# Altium project WV240-E-D001-MC Rev.1.0.PrjPCB
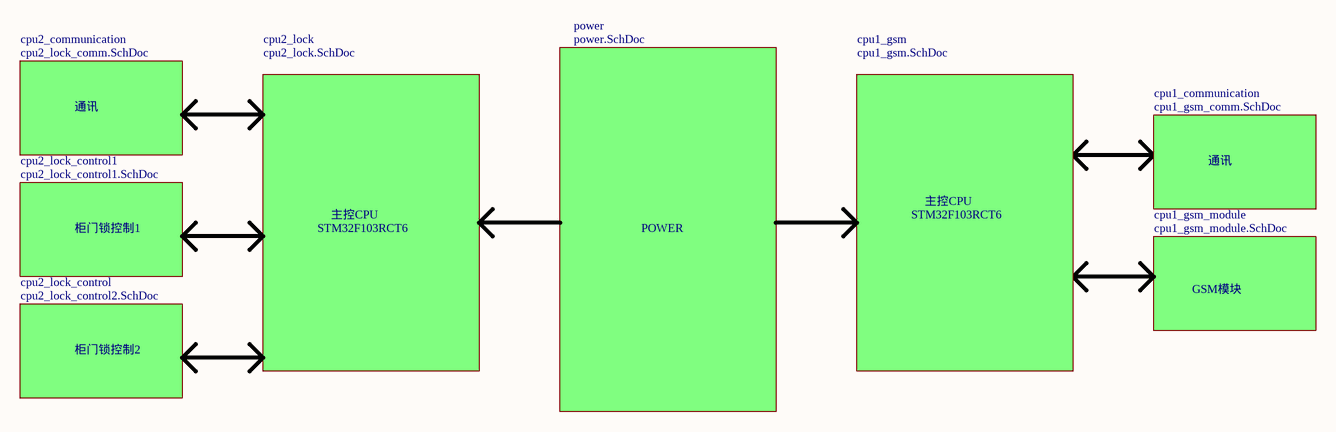
[diagram p0: WV240-E-D001-MC Rev.1.0.SchDoc]
9 sheets, 287 parts. Net scope: global (net labels, ports and power ports of the same name join across sheets).
Board files: WV240-E-D001-MC Rev.1.0.PcbDoc, chicun.PcbDoc
Sheets:
  WV240-E-D001-MC Rev.1.0.SchDoc
    cpu2_lock = cpu2_lock.SchDoc
    cpu1_gsm_module = cpu1_gsm_module.SchDoc
    cpu2_communication = cpu2_lock_comm.SchDoc
    cpu2_lock_control1 = cpu2_lock_control1.SchDoc
    power = power.SchDoc
    cpu1_gsm = cpu1_gsm.SchDoc
    cpu1_communication = cpu1_gsm_comm.SchDoc
    cpu2_lock_control = cpu2_lock_control2.SchDoc

## Sheet WV240-E-D001-MC Rev.1.0.SchDoc
size A3; DocumentNumber: 1; Revision: V1.0; SheetNumber: 1; SheetTotal: 9; Rule: PcbType=ProtelPcb

### Sub-sheets
cpu1_communication = cpu1_gsm_comm.SchDoc: no entries
cpu1_gsm = cpu1_gsm.SchDoc: no entries
cpu1_gsm_module = cpu1_gsm_module.SchDoc: no entries
cpu2_communication = cpu2_lock_comm.SchDoc: no entries
cpu2_lock = cpu2_lock.SchDoc: no entries
cpu2_lock_control = cpu2_lock_control2.SchDoc: no entries
cpu2_lock_control1 = cpu2_lock_control1.SchDoc: no entries
power = power.SchDoc: no entries

### Notes on the sheet
- 通讯
- 主控CPU
- 柜门锁控制1
- STM32F103RCT6
- POWER
- GSM模块
- 柜门锁控制2
- :

## Sheet cpu2_lock.SchDoc
size A3; DocumentNumber: 6; Revision: V1.0; SheetNumber: 6; SheetTotal: 9; Rule: PcbType=ProtelPcb
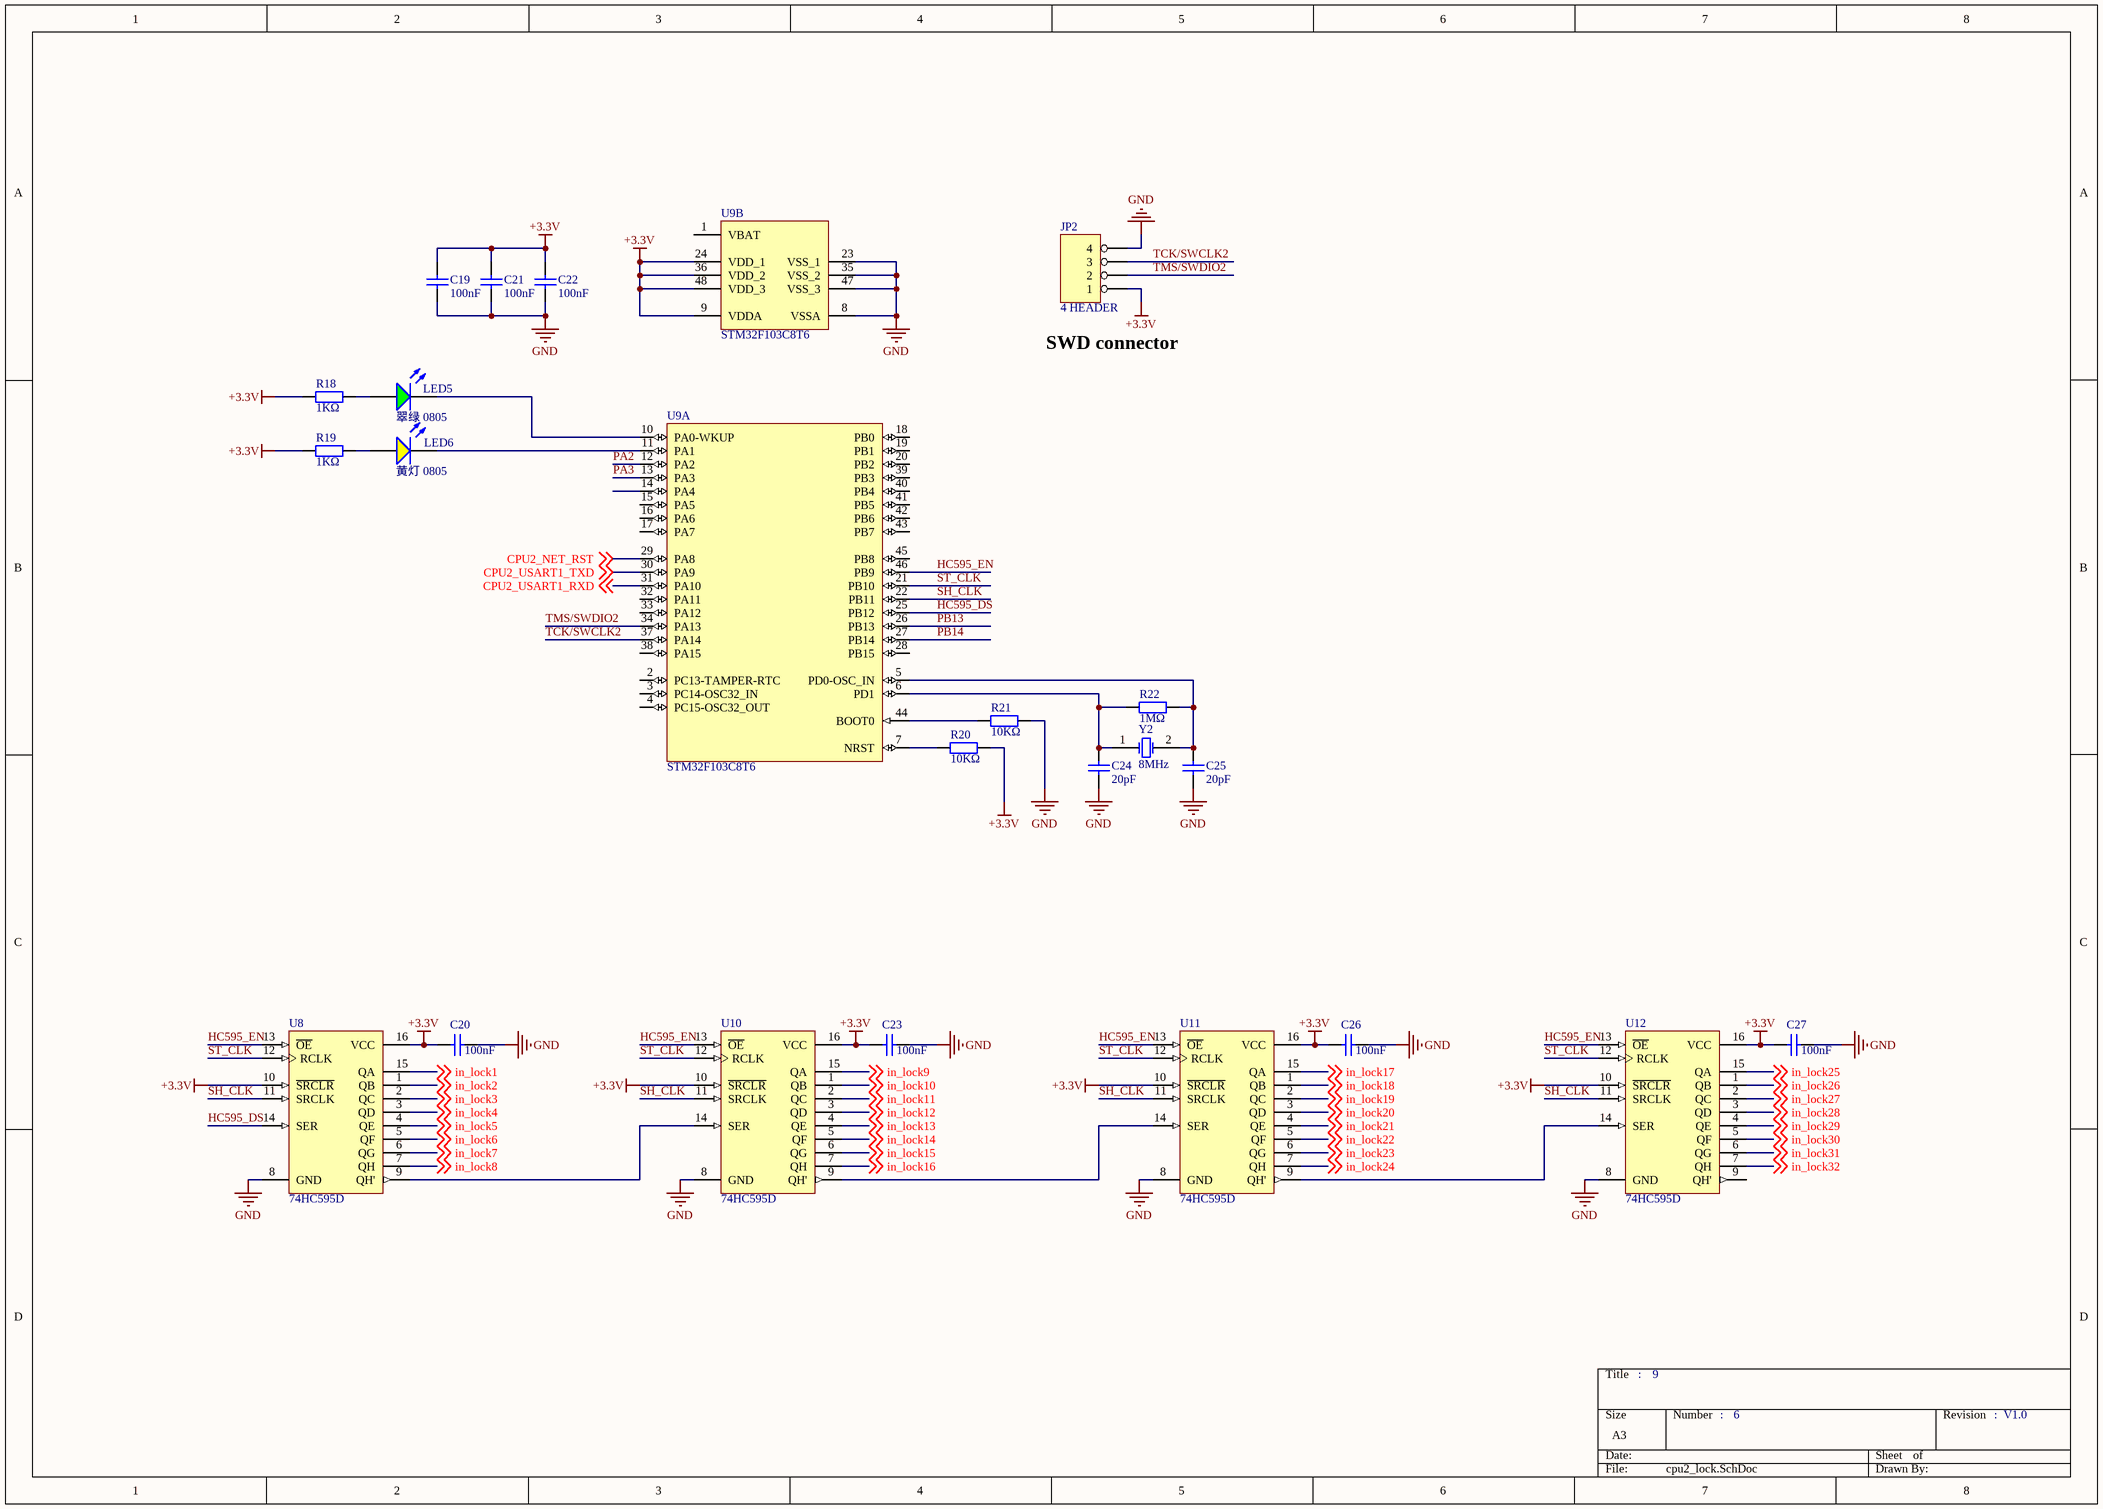
[diagram p1: cpu2_lock.SchDoc]

### Parts
C19  100nF  [0805_C]
C20  100nF  [0805_C]
C21  100nF  [0805_C]
C22  100nF  [0805_C]
C23  100nF  [0805_C]
C24  20pF  [0805_C]
C25  20pF  [0805_C]
C26  100nF  [0805_C]
C27  100nF  [0805_C]
JP2  4 HEADER  [CON4_1.5]
LED5  翠绿 0805  [0805_LED_S1]
LED6  黄灯 0805  [0805_LED_S1]
R18  1KΩ  [0805_R]
R19  1KΩ  [0805_R]
R20  10KΩ  [0805_R]
R21  10KΩ  [0805_R]
R22  1MΩ  [0805_R]
U8  74HC595D  [SOIC-16_150mil]
U9  STM32F103C8T6  [LQFP-48_7x7x05P]  (parts A,B of 2)
U10  74HC595D  [SOIC-16_150mil]
U11  74HC595D  [SOIC-16_150mil]
U12  74HC595D  [SOIC-16_150mil]
Y2  8MHz  [XTAL_US1]

### Nets
+3.3V: C19.2 C20.2 C21.2 C22.2 C23.2 C26.2 C27.2 JP2.1 R18.1 R19.1 R20.1 U8.10(~{SRCLR}) U8.16(VCC) U9.9(VDDA) U9.24(VDD_1) U9.36(VDD_2) U9.48(VDD_3) U10.10(~{SRCLR}) U10.16(VCC) U11.10(~{SRCLR}) U11.16(VCC) U12.10(~{SRCLR}) U12.16(VCC)
GND: C19.1 C20.1 C21.1 C22.1 C23.1 C24.1 C25.1 C26.1 C27.1 JP2.4 R21.1 U8.8(GND) U9.8(VSSA) U9.23(VSS_1) U9.35(VSS_2) U9.47(VSS_3) U10.8(GND) U11.8(GND) U12.8(GND)
CPU2_NET_RST: U9.29(PA8) ; off-sheet CPU2_NET_RST
CPU2_USART1_RXD: U9.31(PA10) ; off-sheet CPU2_USART1_RXD
CPU2_USART1_TXD: U9.30(PA9) ; off-sheet CPU2_USART1_TXD
HC595_DS: U8.14(SER) U9.25(PB12)
HC595_EN: U8.13(~{OE}) U9.46(PB9) U10.13(~{OE}) U11.13(~{OE}) U12.13(~{OE})
in_lock1: U8.15(QA) ; off-sheet in_lock1
in_lock2: U8.1(QB) ; off-sheet in_lock2
in_lock3: U8.2(QC) ; off-sheet in_lock3
in_lock4: U8.3(QD) ; off-sheet in_lock4
in_lock5: U8.4(QE) ; off-sheet in_lock5
in_lock6: U8.5(QF) ; off-sheet in_lock6
in_lock7: U8.6(QG) ; off-sheet in_lock7
in_lock8: U8.7(QH) ; off-sheet in_lock8
in_lock9: U10.15(QA) ; off-sheet in_lock9
in_lock10: U10.1(QB) ; off-sheet in_lock10
in_lock11: U10.2(QC) ; off-sheet in_lock11
in_lock12: U10.3(QD) ; off-sheet in_lock12
in_lock13: U10.4(QE) ; off-sheet in_lock13
in_lock14: U10.5(QF) ; off-sheet in_lock14
in_lock15: U10.6(QG) ; off-sheet in_lock15
in_lock16: U10.7(QH) ; off-sheet in_lock16
in_lock17: U11.15(QA) ; off-sheet in_lock17
in_lock18: U11.1(QB) ; off-sheet in_lock18
in_lock19: U11.2(QC) ; off-sheet in_lock19
in_lock20: U11.3(QD) ; off-sheet in_lock20
in_lock21: U11.4(QE) ; off-sheet in_lock21
in_lock22: U11.5(QF) ; off-sheet in_lock22
in_lock23: U11.6(QG) ; off-sheet in_lock23
in_lock24: U11.7(QH) ; off-sheet in_lock24
in_lock25: U12.15(QA) ; off-sheet in_lock25
in_lock26: U12.1(QB) ; off-sheet in_lock26
in_lock27: U12.2(QC) ; off-sheet in_lock27
in_lock28: U12.3(QD) ; off-sheet in_lock28
in_lock29: U12.4(QE) ; off-sheet in_lock29
in_lock30: U12.5(QF) ; off-sheet in_lock30
in_lock31: U12.6(QG) ; off-sheet in_lock31
in_lock32: U12.7(QH) ; off-sheet in_lock32
PA2: U9.12(PA2)
PA3: U9.13(PA3)
PB13: U9.26(PB13)
PB14: U9.27(PB14)
SH_CLK: U8.11(SRCLK) U9.22(PB11) U10.11(SRCLK) U11.11(SRCLK) U12.11(SRCLK)
ST_CLK: U8.12(RCLK) U9.21(PB10) U10.12(RCLK) U11.12(RCLK) U12.12(RCLK)
TCK/SWCLK2: JP2.3 U9.37(PA14)
TMS/SWDIO2: JP2.2 U9.34(PA13)
NetC24_2: C24.2 R22.2 U9.6(PD1) Y2.1(OSC1)
NetC25_2: C25.2 R22.1 U9.5(PD0-OSC_IN) Y2.2(OSC2)
NetLED5_A: LED5.A R18.2
NetLED5_K: LED5.K U9.10(PA0-WKUP)
NetLED6_A: LED6.A R19.2
NetLED6_K: LED6.K U9.11(PA1)
NetR20_2: R20.2 U9.7(NRST)
NetR21_2: R21.2 U9.44(BOOT0)
NetU8_9: U8.9(QH') U10.14(SER)
NetU10_9: U10.9(QH') U11.14(SER)
NetU11_9: U11.9(QH') U12.14(SER)

Not connected (* = marked no-connect by the designer): U9 1(VBAT) 2(PC13-TAMPER-RTC) 3(PC14-OSC32_IN) 4(PC15-OSC32_OUT) 14(PA4) 15(PA5) 16(PA6) 17(PA7) 18(PB0) 19(PB1) 20(PB2) 28(PB15) 32(PA11) 33(PA12) 38(PA15) 39(PB3) 40(PB4) 41(PB5) 42(PB6) 43(PB7) 45(PB8); U12 9(QH')

### Notes on the sheet
- (near JP2) SWD connector
- :

### Library data of the parts
C19-C27 = 0805 100nF(104) 10% 50V: 贴片电容; ComponentLink1Description: 供应商链接; ComponentLink1URL: http://www.szlcsc.com/product/details_50686.html; Package: 0805; Supplier: LC; SuppliersPartNumber: C49678
JP2 = 4 HEADER: 4 Pin Header
LED5 = 0805 翠绿: 发光二极管; ComponentLink1Description: 供应商链接; ComponentLink1URL: http://www.szlcsc.com/product/details_2670.html; Package: 0805; Supplier: LC; SuppliersPartNumber: C2297
LED6 = 0805 黄灯: 发光二极管; ComponentLink1Description: 供应商链接; ComponentLink1URL: http://www.szlcsc.com/product/details_2669.html; Package: 0805; Supplier: LC; SuppliersPartNumber: C2296
R18-R22 = 0805 11KΩ (1102) 1%: 贴片电阻; ComponentLink1Description: 供应商链接; ComponentLink1URL: http://www.szlcsc.com/product/details_18117.html; Package: 0805; Supplier: LC; SuppliersPartNumber: C17429
U8 U10-U12 = 74HC595D: 74系列逻辑芯片; ComponentLink1Description: 供应商链接; ComponentLink1URL: http://www.szlcsc.com/product/details_6413.html; Package: SOIC-16_150mil; Supplier: LC; SuppliersPartNumber: C5947
U9 = STM32F103C8T6: ARM; ComponentLink1Description: 供应商链接; ComponentLink1URL: http://www.szlcsc.com/product/details_9243.html; Package: LQFP-48_7x7x05P; Supplier: LC; SuppliersPartNumber: C8734
Y2 = XTAL: Crystal Oscillator; Published: 8-Jun-2000; LatestRevisionDate: 17-Jul-2002; LatestRevisionNote: Re-released for DXP Platform.; Publisher: Altium Limited

## Sheet cpu1_gsm_module.SchDoc
size A3; DocumentNumber: 5; Revision: V1.0; SheetNumber: 5; SheetTotal: 9; Rule: PcbType=ProtelPcb
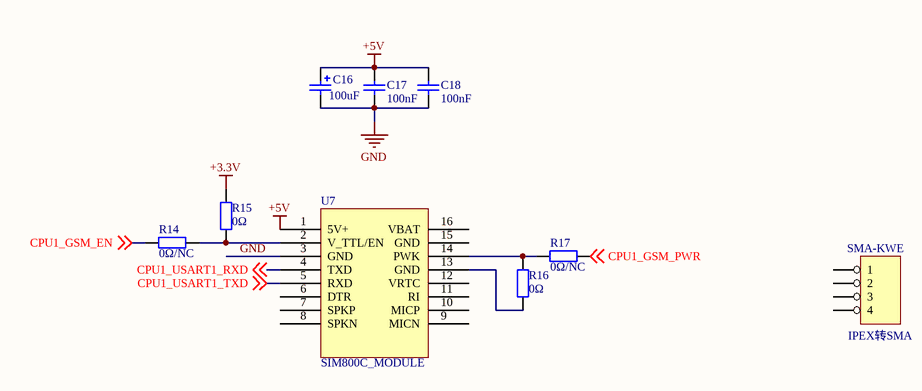
[diagram p2: cpu1_gsm_module.SchDoc]

### Parts
C16  100uF  [CASE-B_3528]
C17  100nF  [0805_C]
C18  100nF  [0805_C]
R14  0Ω/NC  [0805_R]
R15  0Ω  [0805_R]
R16  0Ω  [0805_R]
R17  0Ω/NC  [0805_R]
SMA-KWE  4 HEADER  [SMA-KWE]  (value not drawn)
U7  SIM800C_MODULE  [SIM800C_MODULE]

### Nets
+3.3V: R15.2
+5V: C16.1 C17.2 C18.2 U7.1(5V+)
GND: C16.2 C17.1 C18.1 U7.3(GND)
CPU1_GSM_EN: R14.2 ; off-sheet CPU1_GSM_EN
CPU1_GSM_PWR: R17.1 ; off-sheet CPU1_GSM_PWR
CPU1_USART1_RXD: U7.4(TXD) ; off-sheet CPU1_USART1_RXD
CPU1_USART1_TXD: U7.5(RXD) ; off-sheet CPU1_USART1_TXD
NetR14_1: R14.1 R15.1 U7.2(V_TTL/EN)
NetR16_1: R16.1 R17.2 U7.14(PWK)
NetR16_2: R16.2 U7.13(GND)

Not connected (* = marked no-connect by the designer): SMA-KWE 1 2 3 4; U7 6(DTR) 7(SPKP) 8(SPKN) 9(MICN) 10(MICP) 11(RI) 12(VRTC) 15(GND) 16(VBAT)

### Notes on the sheet
- (near SMA-KWE) IPEX转SMA
- :

### Library data of the parts
C16 = 3528 100uF (107) 10% 6.3V: 钽电容; ComponentLink1Description: 供应商链接; ComponentLink1URL: http://www.szlcsc.com/product/details_16815.html; Package: 3528; Supplier: LC; SuppliersPartNumber: C16133
C17 C18 = 0805 100nF(104) 10% 50V: 贴片电容; ComponentLink1Description: 供应商链接; ComponentLink1URL: http://www.szlcsc.com/product/details_50686.html; Package: 0805; Supplier: LC; SuppliersPartNumber: C49678
R14-R17 = 0805 11KΩ (1102) 1%: 贴片电阻; ComponentLink1Description: 供应商链接; ComponentLink1URL: http://www.szlcsc.com/product/details_18117.html; Package: 0805; Supplier: LC; SuppliersPartNumber: C17429
SMA-KWE = 4 HEADER: 4 Pin Header

## Sheet cpu2_lock_comm.SchDoc
size A3; DocumentNumber: 7; Revision: V1.0; SheetNumber: 7; SheetTotal: 9; Rule: PcbType=ProtelPcb
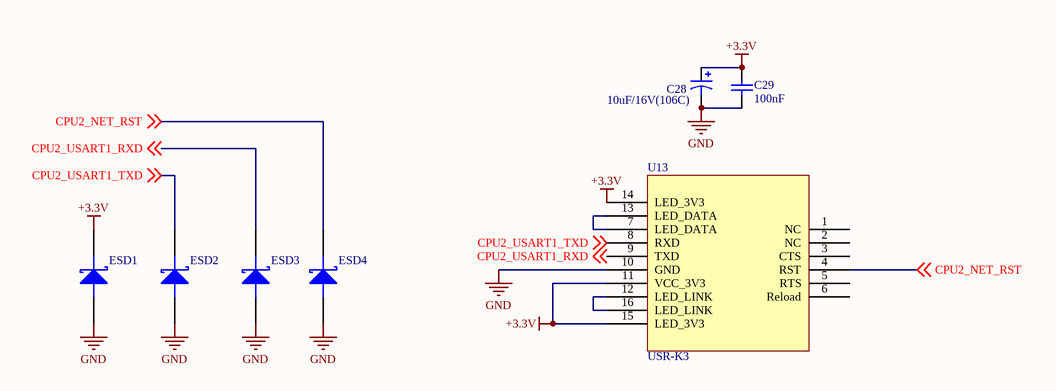
[diagram p3: cpu2_lock_comm.SchDoc]

### Parts
C28  value 10uF/16V(106C)  [CAP A-3216]  (hidden comment: Cap Pol3)
C29  100nF  [0805_C]
ESD1  ESD5B5.0ST1G  [SOD-523]  (value not drawn)
ESD2  ESD5B5.0ST1G  [SOD-523]  (value not drawn)
ESD3  ESD5B5.0ST1G  [SOD-523]  (value not drawn)
ESD4  ESD5B5.0ST1G  [SOD-523]  (value not drawn)
U13  USR-K3  [USR-K3]

### Nets
+3.3V: C28.1 C29.2 ESD1.2 U13.11(VCC_3V3) U13.14(LED_3V3) U13.15(LED_3V3)
GND: C28.2 C29.1 ESD1.1 ESD2.1 ESD3.1 ESD4.1 U13.10(GND)
CPU2_NET_RST: ESD4.2 U13.4(RST) ; off-sheet CPU2_NET_RST
CPU2_USART1_RXD: ESD3.2 U13.9(TXD) ; off-sheet CPU2_USART1_RXD
CPU2_USART1_TXD: ESD2.2 U13.8(RXD) ; off-sheet CPU2_USART1_TXD
NetU13_7: U13.7(LED_DATA) U13.13(LED_DATA)
NetU13_12: U13.12(LED_LINK) U13.16(LED_LINK)

Not connected (* = marked no-connect by the designer): U13 1(NC) 2(NC) 3(CTS) 5(RTS) 6(Reload)

### Notes on the sheet
- :

### Library data of the parts
C28 = Cap Pol3: Polarized Capacitor (Surface Mount); Published: 8-Jun-2000; LatestRevisionDate: 17-Jul-2002; LatestRevisionNote: Re-released for DXP Platform.; PackageReference: C0805; Publisher: Altium Limited
C29 = 0805 100nF(104) 10% 50V: 贴片电容; ComponentLink1Description: 供应商链接; ComponentLink1URL: http://www.szlcsc.com/product/details_50686.html; Package: 0805; Supplier: LC; SuppliersPartNumber: C49678

## Sheet cpu2_lock_control1.SchDoc
size A3; DocumentNumber: 8; Revision: V1.0; SheetNumber: 8; SheetTotal: 9; Rule: PcbType=ProtelPcb
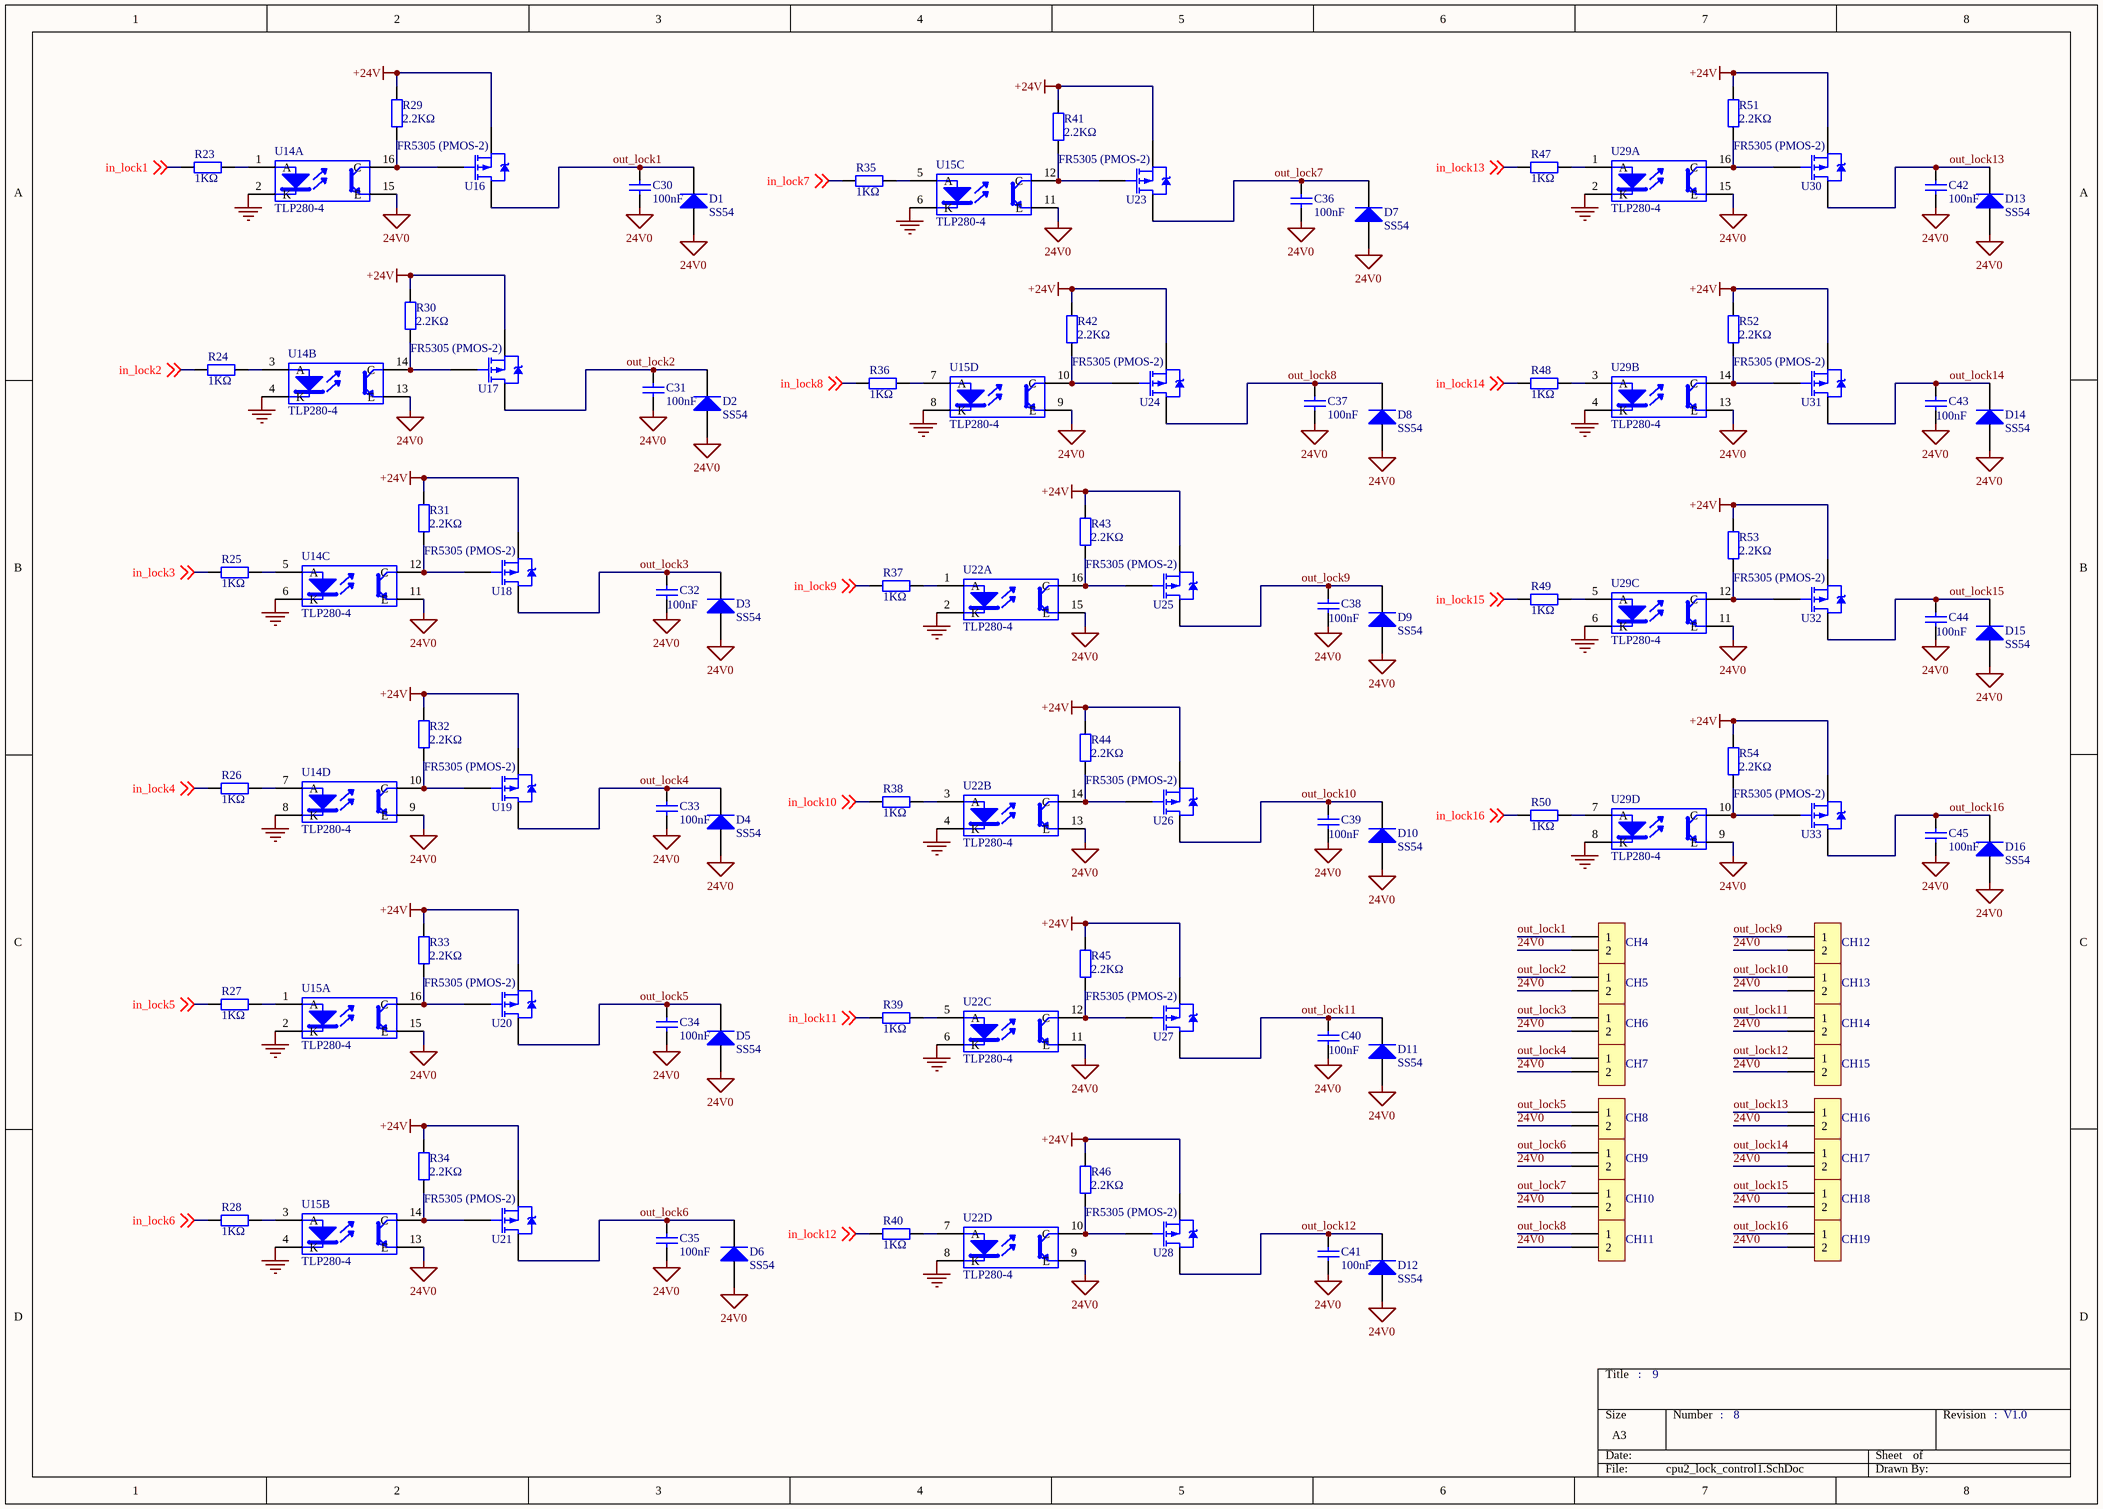
[diagram p4: cpu2_lock_control1.SchDoc]

### Parts
C30  100nF  [0805_C]
C31  100nF  [0805_C]
C32  100nF  [0805_C]
C33  100nF  [0805_C]
C34  100nF  [0805_C]
C35  100nF  [0805_C]
C36  100nF  [0805_C]
C37  100nF  [0805_C]
C38  100nF  [0805_C]
C39  100nF  [0805_C]
C40  100nF  [0805_C]
C41  100nF  [0805_C]
C42  100nF  [0805_C]
C43  100nF  [0805_C]
C44  100nF  [0805_C]
C45  100nF  [0805_C]
CH4  HEADER1X2  [CH3.96-2PIN]  (value not drawn)
CH5  HEADER1X2  [CH3.96-2PIN]  (value not drawn)
CH6  HEADER1X2  [CH3.96-2PIN]  (value not drawn)
CH7  HEADER1X2  [CH3.96-2PIN]  (value not drawn)
CH8  HEADER1X2  [CH3.96-2PIN]  (value not drawn)
CH9  HEADER1X2  [CH3.96-2PIN]  (value not drawn)
CH10  HEADER1X2  [CH3.96-2PIN]  (value not drawn)
CH11  HEADER1X2  [CH3.96-2PIN]  (value not drawn)
CH12  HEADER1X2  [CH3.96-2PIN]  (value not drawn)
CH13  HEADER1X2  [CH3.96-2PIN]  (value not drawn)
CH14  HEADER1X2  [CH3.96-2PIN]  (value not drawn)
CH15  HEADER1X2  [CH3.96-2PIN]  (value not drawn)
CH16  HEADER1X2  [CH3.96-2PIN]  (value not drawn)
CH17  HEADER1X2  [CH3.96-2PIN]  (value not drawn)
CH18  HEADER1X2  [CH3.96-2PIN]  (value not drawn)
CH19  HEADER1X2  [CH3.96-2PIN]  (value not drawn)
D1  SS54  [SMA(DO-214AC)_S1]
D2  SS54  [SMA(DO-214AC)_S1]
D3  SS54  [SMA(DO-214AC)_S1]
D4  SS54  [SMA(DO-214AC)_S1]
D5  SS54  [SMA(DO-214AC)_S1]
D6  SS54  [SMA(DO-214AC)_S1]
D7  SS54  [SMA(DO-214AC)_S1]
D8  SS54  [SMA(DO-214AC)_S1]
D9  SS54  [SMA(DO-214AC)_S1]
D10  SS54  [SMA(DO-214AC)_S1]
D11  SS54  [SMA(DO-214AC)_S1]
D12  SS54  [SMA(DO-214AC)_S1]
D13  SS54  [SMA(DO-214AC)_S1]
D14  SS54  [SMA(DO-214AC)_S1]
D15  SS54  [SMA(DO-214AC)_S1]
D16  SS54  [SMA(DO-214AC)_S1]
R23  1KΩ  [0805_R]
R24  1KΩ  [0805_R]
R25  1KΩ  [0805_R]
R26  1KΩ  [0805_R]
R27  1KΩ  [0805_R]
R28  1KΩ  [0805_R]
R29  2.2KΩ  [0805_R]
R30  2.2KΩ  [0805_R]
R31  2.2KΩ  [0805_R]
R32  2.2KΩ  [0805_R]
R33  2.2KΩ  [0805_R]
R34  2.2KΩ  [0805_R]
R35  1KΩ  [0805_R]
R36  1KΩ  [0805_R]
R37  1KΩ  [0805_R]
R38  1KΩ  [0805_R]
R39  1KΩ  [0805_R]
R40  1KΩ  [0805_R]
R41  2.2KΩ  [0805_R]
R42  2.2KΩ  [0805_R]
R43  2.2KΩ  [0805_R]
R44  2.2KΩ  [0805_R]
R45  2.2KΩ  [0805_R]
R46  2.2KΩ  [0805_R]
R47  1KΩ  [0805_R]
R48  1KΩ  [0805_R]
R49  1KΩ  [0805_R]
R50  1KΩ  [0805_R]
R51  2.2KΩ  [0805_R]
R52  2.2KΩ  [0805_R]
R53  2.2KΩ  [0805_R]
R54  2.2KΩ  [0805_R]
U14  TLP280-4  [SO16]  (parts A,B,C,D of 4)
U15  TLP280-4  [SO16]  (parts A,B,C,D of 4)
U16  FR5305 (PMOS-2)  [TO-252]
U17  FR5305 (PMOS-2)  [TO-252]
U18  FR5305 (PMOS-2)  [TO-252]
U19  FR5305 (PMOS-2)  [TO-252]
U20  FR5305 (PMOS-2)  [TO-252]
U21  FR5305 (PMOS-2)  [TO-252]
U22  TLP280-4  [SO16]  (parts A,B,C,D of 4)
U23  FR5305 (PMOS-2)  [TO-252]
U24  FR5305 (PMOS-2)  [TO-252]
U25  FR5305 (PMOS-2)  [TO-252]
U26  FR5305 (PMOS-2)  [TO-252]
U27  FR5305 (PMOS-2)  [TO-252]
U28  FR5305 (PMOS-2)  [TO-252]
U29  TLP280-4  [SO16]  (parts A,B,C,D of 4)
U30  FR5305 (PMOS-2)  [TO-252]
U31  FR5305 (PMOS-2)  [TO-252]
U32  FR5305 (PMOS-2)  [TO-252]
U33  FR5305 (PMOS-2)  [TO-252]

### Nets
24V0: C30.1 C31.1 C32.1 C33.1 C34.1 C35.1 C36.1 C37.1 C38.1 C39.1 C40.1 C41.1 C42.1 C43.1 C44.1 C45.1 CH4.2 CH5.2 CH6.2 CH7.2 CH8.2 CH9.2 CH10.2 CH11.2 CH12.2 CH13.2 CH14.2 CH15.2 CH16.2 CH17.2 CH18.2 CH19.2 D1.1(A) D2.1(A) D3.1(A) D4.1(A) D5.1(A) D6.1(A) D7.1(A) D8.1(A) D9.1(A) D10.1(A) D11.1(A) D12.1(A) D13.1(A) D14.1(A) D15.1(A) D16.1(A) U14.9(E) U14.11(E) U14.13(E) U14.15(E) U15.9(E) U15.11(E) U15.13(E) U15.15(E) U22.9(E) U22.11(E) U22.13(E) U22.15(E) U29.9(E) U29.11(E) U29.13(E) U29.15(E)
+24V: R29.2 R30.2 R31.2 R32.2 R33.2 R34.2 R41.2 R42.2 R43.2 R44.2 R45.2 R46.2 R51.2 R52.2 R53.2 R54.2 U16.3(S) U17.3(S) U18.3(S) U19.3(S) U20.3(S) U21.3(S) U23.3(S) U24.3(S) U25.3(S) U26.3(S) U27.3(S) U28.3(S) U30.3(S) U31.3(S) U32.3(S) U33.3(S)
GND: U14.2(K) U14.4(K) U14.6(K) U14.8(K) U15.2(K) U15.4(K) U15.6(K) U15.8(K) U22.2(K) U22.4(K) U22.6(K) U22.8(K) U29.2(K) U29.4(K) U29.6(K) U29.8(K)
in_lock1: R23.1 ; off-sheet in_lock1
in_lock2: R24.1 ; off-sheet in_lock2
in_lock3: R25.1 ; off-sheet in_lock3
in_lock4: R26.1 ; off-sheet in_lock4
in_lock5: R27.1 ; off-sheet in_lock5
in_lock6: R28.1 ; off-sheet in_lock6
in_lock7: R35.1 ; off-sheet in_lock7
in_lock8: R36.1 ; off-sheet in_lock8
in_lock9: R37.1 ; off-sheet in_lock9
in_lock10: R38.1 ; off-sheet in_lock10
in_lock11: R39.1 ; off-sheet in_lock11
in_lock12: R40.1 ; off-sheet in_lock12
in_lock13: R47.1 ; off-sheet in_lock13
in_lock14: R48.1 ; off-sheet in_lock14
in_lock15: R49.1 ; off-sheet in_lock15
in_lock16: R50.1 ; off-sheet in_lock16
out_lock1: C30.2 CH4.1 D1.2(K) U16.2(D)
out_lock2: C31.2 CH5.1 D2.2(K) U17.2(D)
out_lock3: C32.2 CH6.1 D3.2(K) U18.2(D)
out_lock4: C33.2 CH7.1 D4.2(K) U19.2(D)
out_lock5: C34.2 CH8.1 D5.2(K) U20.2(D)
out_lock6: C35.2 CH9.1 D6.2(K) U21.2(D)
out_lock7: C36.2 CH10.1 D7.2(K) U23.2(D)
out_lock8: C37.2 CH11.1 D8.2(K) U24.2(D)
out_lock9: C38.2 CH12.1 D9.2(K) U25.2(D)
out_lock10: C39.2 CH13.1 D10.2(K) U26.2(D)
out_lock11: C40.2 CH14.1 D11.2(K) U27.2(D)
out_lock12: C41.2 CH15.1 D12.2(K) U28.2(D)
out_lock13: C42.2 CH16.1 D13.2(K) U30.2(D)
out_lock14: C43.2 CH17.1 D14.2(K) U31.2(D)
out_lock15: C44.2 CH18.1 D15.2(K) U32.2(D)
out_lock16: C45.2 CH19.1 D16.2(K) U33.2(D)
NetR23_2: R23.2 U14.1(A)
NetR24_2: R24.2 U14.3(A)
NetR25_2: R25.2 U14.5(A)
NetR26_2: R26.2 U14.7(A)
NetR27_2: R27.2 U15.1(A)
NetR28_2: R28.2 U15.3(A)
NetR29_1: R29.1 U14.16(C) U16.1(G)
NetR30_1: R30.1 U14.14(C) U17.1(G)
NetR31_1: R31.1 U14.12(C) U18.1(G)
NetR32_1: R32.1 U14.10(C) U19.1(G)
NetR33_1: R33.1 U15.16(C) U20.1(G)
NetR34_1: R34.1 U15.14(C) U21.1(G)
NetR35_2: R35.2 U15.5(A)
NetR36_2: R36.2 U15.7(A)
NetR37_2: R37.2 U22.1(A)
NetR38_2: R38.2 U22.3(A)
NetR39_2: R39.2 U22.5(A)
NetR40_2: R40.2 U22.7(A)
NetR41_1: R41.1 U15.12(C) U23.1(G)
NetR42_1: R42.1 U15.10(C) U24.1(G)
NetR43_1: R43.1 U22.16(C) U25.1(G)
NetR44_1: R44.1 U22.14(C) U26.1(G)
NetR45_1: R45.1 U22.12(C) U27.1(G)
NetR46_1: R46.1 U22.10(C) U28.1(G)
NetR47_2: R47.2 U29.1(A)
NetR48_2: R48.2 U29.3(A)
NetR49_2: R49.2 U29.5(A)
NetR50_2: R50.2 U29.7(A)
NetR51_1: R51.1 U29.16(C) U30.1(G)
NetR52_1: R52.1 U29.14(C) U31.1(G)
NetR53_1: R53.1 U29.12(C) U32.1(G)
NetR54_1: R54.1 U29.10(C) U33.1(G)

### Notes on the sheet
- :

### Library data of the parts
C30-C45 = 0805 100nF(104) 10% 50V: 贴片电容; ComponentLink1Description: 供应商链接; ComponentLink1URL: http://www.szlcsc.com/product/details_50686.html; Package: 0805; Supplier: LC; SuppliersPartNumber: C49678
D1-D16 = SMA(DO-214AC) SS54: 二极管; ComponentLink1Description: 供应商链接; ComponentLink1URL: http://www.szlcsc.com/product/details_23178.html; Package: SMA(DO-214AC); Supplier: LC; SuppliersPartNumber: C22452
R23-R54 = 0805 11KΩ (1102) 1%: 贴片电阻; ComponentLink1Description: 供应商链接; ComponentLink1URL: http://www.szlcsc.com/product/details_18117.html; Package: 0805; Supplier: LC; SuppliersPartNumber: C17429
U14 U15 U22 U29 = TLP521-4
U16-U21 U23-U28 U30-U33 = PMOS-2: P-Channel Power MOSFET; Note: Pin 4 not drawn and electrically connected to Pin 2.; Published: 8-Jun-2000; LatestRevisionDate: 17-Jul-2002; LatestRevisionNote: Re-released for DXP Platform.; DatasheetDocument: PD-9.390D; PackageReference: TO-220AB; Publisher: Altium Limited; Code_JEDEC: TO-220-AB; ComponentLink1Description: Manufacturer Link; ComponentLink1URL: http://www.irf.com/

## Sheet power.SchDoc
size A3; DocumentNumber: 2; Revision: V1.0; SheetNumber: 2; SheetTotal: 9; Rule: PcbType=ProtelPcb
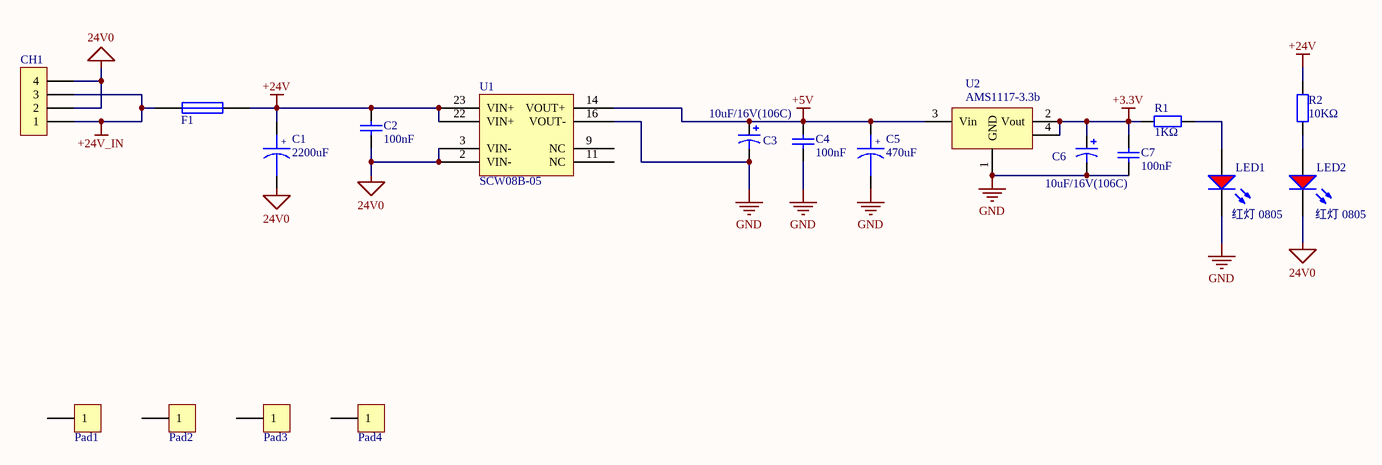
[diagram p5: power.SchDoc]

### Parts
C1  value 2200uF  [C7.8*17]  (hidden comment: C_2200uF)
C2  100nF  [0805_C]
C3  value 10uF/16V(106C)  [CAP A-3216]  (hidden comment: Cap Pol3b)
C4  100nF  [0805_C]
C5  value 470uF  [C5*10]  (hidden comment: C_2200uF)
C6  value 10uF/16V(106C)  [CAP A-3216]  (hidden comment: Cap Pol3b)
C7  100nF  [0805_C]
CH1  HEADER1X4  [CH3.96-4PIN]  (value not drawn)
F1  FUSE  [X30UF900]  (value not drawn)
LED1  红灯 0805  [0805_LED_S1]
LED2  红灯 0805  [0805_LED_S1]
Pad1  Pad  [pad35]  (value not drawn)
Pad2  Pad  [pad35]  (value not drawn)
Pad3  Pad  [pad35]  (value not drawn)
Pad4  Pad  [pad35]  (value not drawn)
R1  1KΩ  [0805_R]
R2  10KΩ  [0805_R]
U1  SCW08B-05  [SCW08B-05]
U2  AMS1117-3.3b  [SOT223]

### Nets
24V0: C1.2 C2.1 CH1.2 CH1.4 LED2.K U1.2(VIN-) U1.3(VIN-)
+3.3V: C6.1 C7.2 R1.1 U2.2(Vout) U2.4
+5V: C3.1 C4.2 C5.1 U1.14(VOUT+) U2.3(Vin)
+24V: C1.1 C2.2 F1.2 R2.2 U1.22(VIN+) U1.23(VIN+)
+24V_IN: CH1.1 CH1.3 F1.1
GND: C3.2 C4.1 C5.2 C6.2 C7.1 LED1.K U1.16(VOUT-) U2.1(GND)
NetLED1_A: LED1.A R1.2
NetLED2_A: LED2.A R2.1

Not connected (* = marked no-connect by the designer): Pad1 1; Pad2 1; Pad3 1; Pad4 1; U1 9(NC) 11(NC)

### Notes on the sheet
- :
- (in symbol C_2200uF) +

### Library data of the parts
C2 C4 C7 = 0805 100nF(104) 10% 50V: 贴片电容; ComponentLink1Description: 供应商链接; ComponentLink1URL: http://www.szlcsc.com/product/details_50686.html; Package: 0805; Supplier: LC; SuppliersPartNumber: C49678
C3 C6 = Cap Pol3: Polarized Capacitor (Surface Mount); Published: 8-Jun-2000; LatestRevisionDate: 17-Jul-2002; LatestRevisionNote: Re-released for DXP Platform.; PackageReference: C0805; Publisher: Altium Limited
LED1 LED2 = 0805 红灯: 发光二极管; ComponentLink1Description: 供应商链接; ComponentLink1URL: http://www.szlcsc.com/product/details_2668.html; Package: 0805; Supplier: LC; SuppliersPartNumber: C2295
R1 R2 = 0805 11KΩ (1102) 1%: 贴片电阻; ComponentLink1Description: 供应商链接; ComponentLink1URL: http://www.szlcsc.com/product/details_18117.html; Package: 0805; Supplier: LC; SuppliersPartNumber: C17429
U2 = AMS1117-5

## Sheet cpu1_gsm.SchDoc
size A3; DocumentNumber: 3; Revision: V1.0; SheetNumber: 3; SheetTotal: 9; Rule: PcbType=ProtelPcb
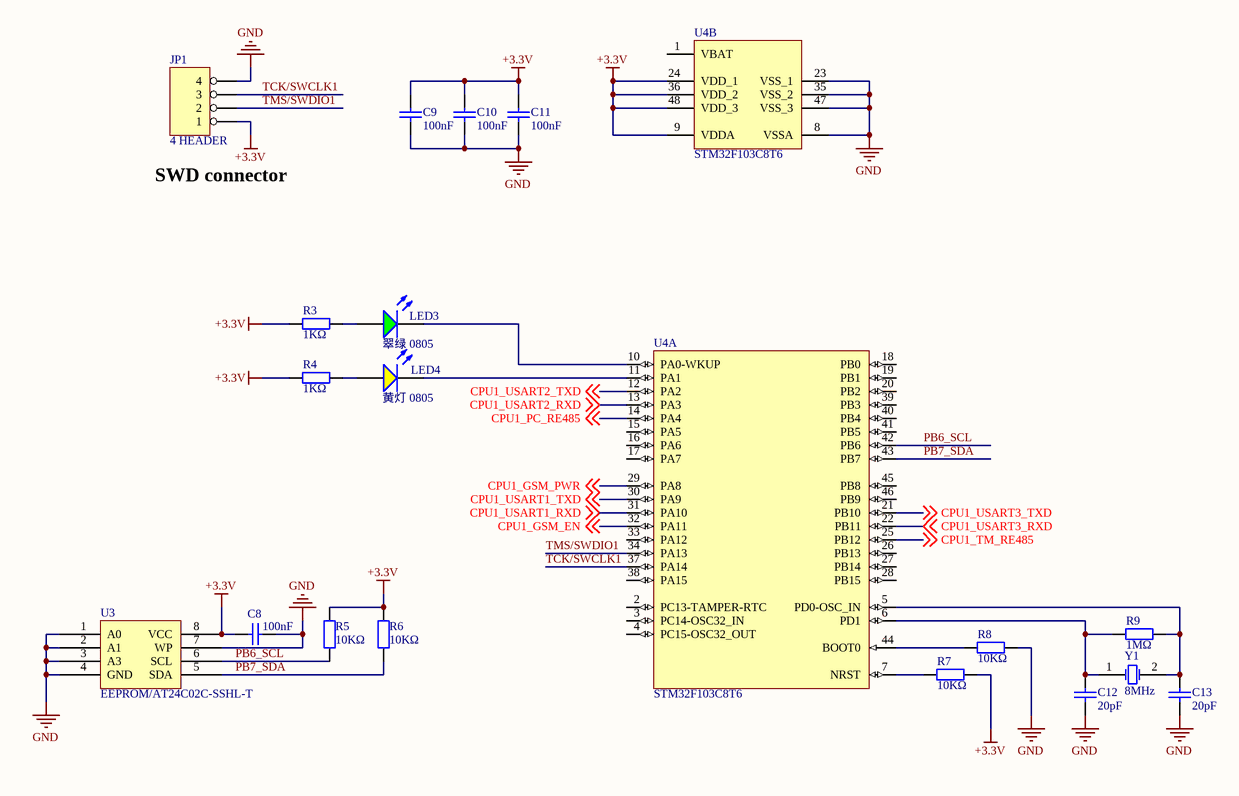
[diagram p6: cpu1_gsm.SchDoc]

### Parts
C8  100nF  [0805_C]
C9  100nF  [0805_C]
C10  100nF  [0805_C]
C11  100nF  [0805_C]
C12  20pF  [0805_C]
C13  20pF  [0805_C]
JP1  4 HEADER  [CON4_1.5]
LED3  翠绿 0805  [0805_LED_S1]
LED4  黄灯 0805  [0805_LED_S1]
R3  1KΩ  [0805_R]
R4  1KΩ  [0805_R]
R5  10KΩ  [0805_R]
R6  10KΩ  [0805_R]
R7  10KΩ  [0805_R]
R8  10KΩ  [0805_R]
R9  1MΩ  [0805_R]
U3  EEPROM/AT24C02C-SSHL-T  [SOIC-8_150mil]
U4  STM32F103C8T6  [LQFP-48_7x7x05P]  (parts A,B of 2)
Y1  8MHz  [XTAL_US1]

### Nets
+3.3V: C8.2 C9.2 C10.2 C11.2 JP1.1 R3.1 R4.1 R5.1 R6.1 R7.1 U3.8(VCC) U4.9(VDDA) U4.24(VDD_1) U4.36(VDD_2) U4.48(VDD_3)
GND: C8.1 C9.1 C10.1 C11.1 C12.1 C13.1 JP1.4 R8.1 U3.1(A0) U3.2(A1) U3.3(A3) U3.4(GND) U3.7(WP) U4.8(VSSA) U4.23(VSS_1) U4.35(VSS_2) U4.47(VSS_3)
CPU1_GSM_EN: U4.32(PA11) ; off-sheet CPU1_GSM_EN
CPU1_GSM_PWR: U4.29(PA8) ; off-sheet CPU1_GSM_PWR
CPU1_PC_RE485: U4.14(PA4) ; off-sheet CPU1_PC_RE485
CPU1_TM_RE485: U4.25(PB12) ; off-sheet CPU1_TM_RE485
CPU1_USART1_RXD: U4.31(PA10) ; off-sheet CPU1_USART1_RXD
CPU1_USART1_TXD: U4.30(PA9) ; off-sheet CPU1_USART1_TXD
CPU1_USART2_RXD: U4.13(PA3) ; off-sheet CPU1_USART2_RXD
CPU1_USART2_TXD: U4.12(PA2) ; off-sheet CPU1_USART2_TXD
CPU1_USART3_RXD: U4.22(PB11) ; off-sheet CPU1_USART3_RXD
CPU1_USART3_TXD: U4.21(PB10) ; off-sheet CPU1_USART3_TXD
PB6_SCL: R5.2 U3.6(SCL) U4.42(PB6)
PB7_SDA: R6.2 U3.5(SDA) U4.43(PB7)
TCK/SWCLK1: JP1.3 U4.37(PA14)
TMS/SWDIO1: JP1.2 U4.34(PA13)
NetC12_2: C12.2 R9.2 U4.6(PD1) Y1.1(OSC1)
NetC13_2: C13.2 R9.1 U4.5(PD0-OSC_IN) Y1.2(OSC2)
NetLED3_A: LED3.A R3.2
NetLED3_K: LED3.K U4.10(PA0-WKUP)
NetLED4_A: LED4.A R4.2
NetLED4_K: LED4.K U4.11(PA1)
NetR7_2: R7.2 U4.7(NRST)
NetR8_2: R8.2 U4.44(BOOT0)

Not connected (* = marked no-connect by the designer): U4 1(VBAT) 2(PC13-TAMPER-RTC) 3(PC14-OSC32_IN) 4(PC15-OSC32_OUT) 15(PA5) 16(PA6) 17(PA7) 18(PB0) 19(PB1) 20(PB2) 26(PB13) 27(PB14) 28(PB15) 33(PA12) 38(PA15) 39(PB3) 40(PB4) 41(PB5) 45(PB8) 46(PB9)

### Notes on the sheet
- (near JP1) SWD connector
- :

### Library data of the parts
C8-C13 = 0805 100nF(104) 10% 50V: 贴片电容; ComponentLink1Description: 供应商链接; ComponentLink1URL: http://www.szlcsc.com/product/details_50686.html; Package: 0805; Supplier: LC; SuppliersPartNumber: C49678
JP1 = 4 HEADER: 4 Pin Header
LED3 = 0805 翠绿: 发光二极管; ComponentLink1Description: 供应商链接; ComponentLink1URL: http://www.szlcsc.com/product/details_2670.html; Package: 0805; Supplier: LC; SuppliersPartNumber: C2297
LED4 = 0805 黄灯: 发光二极管; ComponentLink1Description: 供应商链接; ComponentLink1URL: http://www.szlcsc.com/product/details_2669.html; Package: 0805; Supplier: LC; SuppliersPartNumber: C2296
R3-R9 = 0805 11KΩ (1102) 1%: 贴片电阻; ComponentLink1Description: 供应商链接; ComponentLink1URL: http://www.szlcsc.com/product/details_18117.html; Package: 0805; Supplier: LC; SuppliersPartNumber: C17429
U3 = EEPROM/AT24C256C-SSHL-T: EEPROM; ComponentLink1Description: 供应商链接; ComponentLink1URL: http://www.szlcsc.com/product/details_6947.html; Package: SOIC-8_150mil; Supplier: LC; SuppliersPartNumber: C6482
U4 = STM32F103C8T6: ARM; ComponentLink1Description: 供应商链接; ComponentLink1URL: http://www.szlcsc.com/product/details_9243.html; Package: LQFP-48_7x7x05P; Supplier: LC; SuppliersPartNumber: C8734
Y1 = XTAL: Crystal Oscillator; Published: 8-Jun-2000; LatestRevisionDate: 17-Jul-2002; LatestRevisionNote: Re-released for DXP Platform.; Publisher: Altium Limited

## Sheet cpu1_gsm_comm.SchDoc
size A3; DocumentNumber: 4; Revision: V1.0; SheetNumber: 4; SheetTotal: 9; Rule: PcbType=ProtelPcb
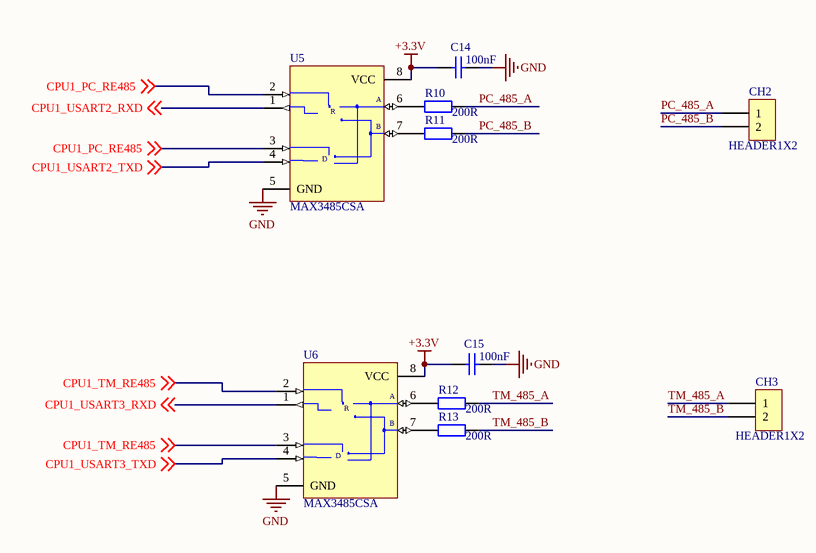
[diagram p7: cpu1_gsm_comm.SchDoc]

### Parts
C14  100nF  [0805_C]
C15  100nF  [0805_C]
CH2  HEADER1X2  [CH3.96-2PIN]
CH3  HEADER1X2  [CH3.96-2PIN]
R10  200R  [0805_R]
R11  200R  [0805_R]
R12  200R  [0805_R]
R13  200R  [0805_R]
U5  MAX3485CSA  [NS08-L]
U6  MAX3485CSA  [NS08-L]

### Nets
+3.3V: C14.2 C15.2 U5.8(VCC) U6.8(VCC)
GND: C14.1 C15.1 U5.5(GND) U6.5(GND)
CPU1_PC_RE485: U5.2(~{RE}) U5.3(DE) ; off-sheet CPU1_PC_RE485
CPU1_TM_RE485: U6.2(~{RE}) U6.3(DE) ; off-sheet CPU1_TM_RE485
CPU1_USART2_RXD: U5.1(RO) ; off-sheet CPU1_USART2_RXD
CPU1_USART2_TXD: U5.4(DI) ; off-sheet CPU1_USART2_TXD
CPU1_USART3_RXD: U6.1(RO) ; off-sheet CPU1_USART3_RXD
CPU1_USART3_TXD: U6.4(DI) ; off-sheet CPU1_USART3_TXD
PC_485_A: CH2.1 R10.2
PC_485_B: CH2.2 R11.2
TM_485_A: CH3.1 R12.2
TM_485_B: CH3.2 R13.2
NetR10_1: R10.1 U5.6(A)
NetR11_1: R11.1 U5.7(B)
NetR12_1: R12.1 U6.6(A)
NetR13_1: R13.1 U6.7(B)

### Notes on the sheet
- :
- (in symbol MAX485CSA) R; D

### Library data of the parts
C14 C15 = 0805 100nF(104) 10% 50V: 贴片电容; ComponentLink1Description: 供应商链接; ComponentLink1URL: http://www.szlcsc.com/product/details_50686.html; Package: 0805; Supplier: LC; SuppliersPartNumber: C49678
R10-R13 = 0805 11KΩ (1102) 1%: 贴片电阻; ComponentLink1Description: 供应商链接; ComponentLink1URL: http://www.szlcsc.com/product/details_18117.html; Package: 0805; Supplier: LC; SuppliersPartNumber: C17429
U5 U6 = MAX485CSA

## Sheet cpu2_lock_control2.SchDoc
size A3; DocumentNumber: 9; Revision: V1.0; SheetNumber: 9; SheetTotal: 9; Rule: PcbType=ProtelPcb
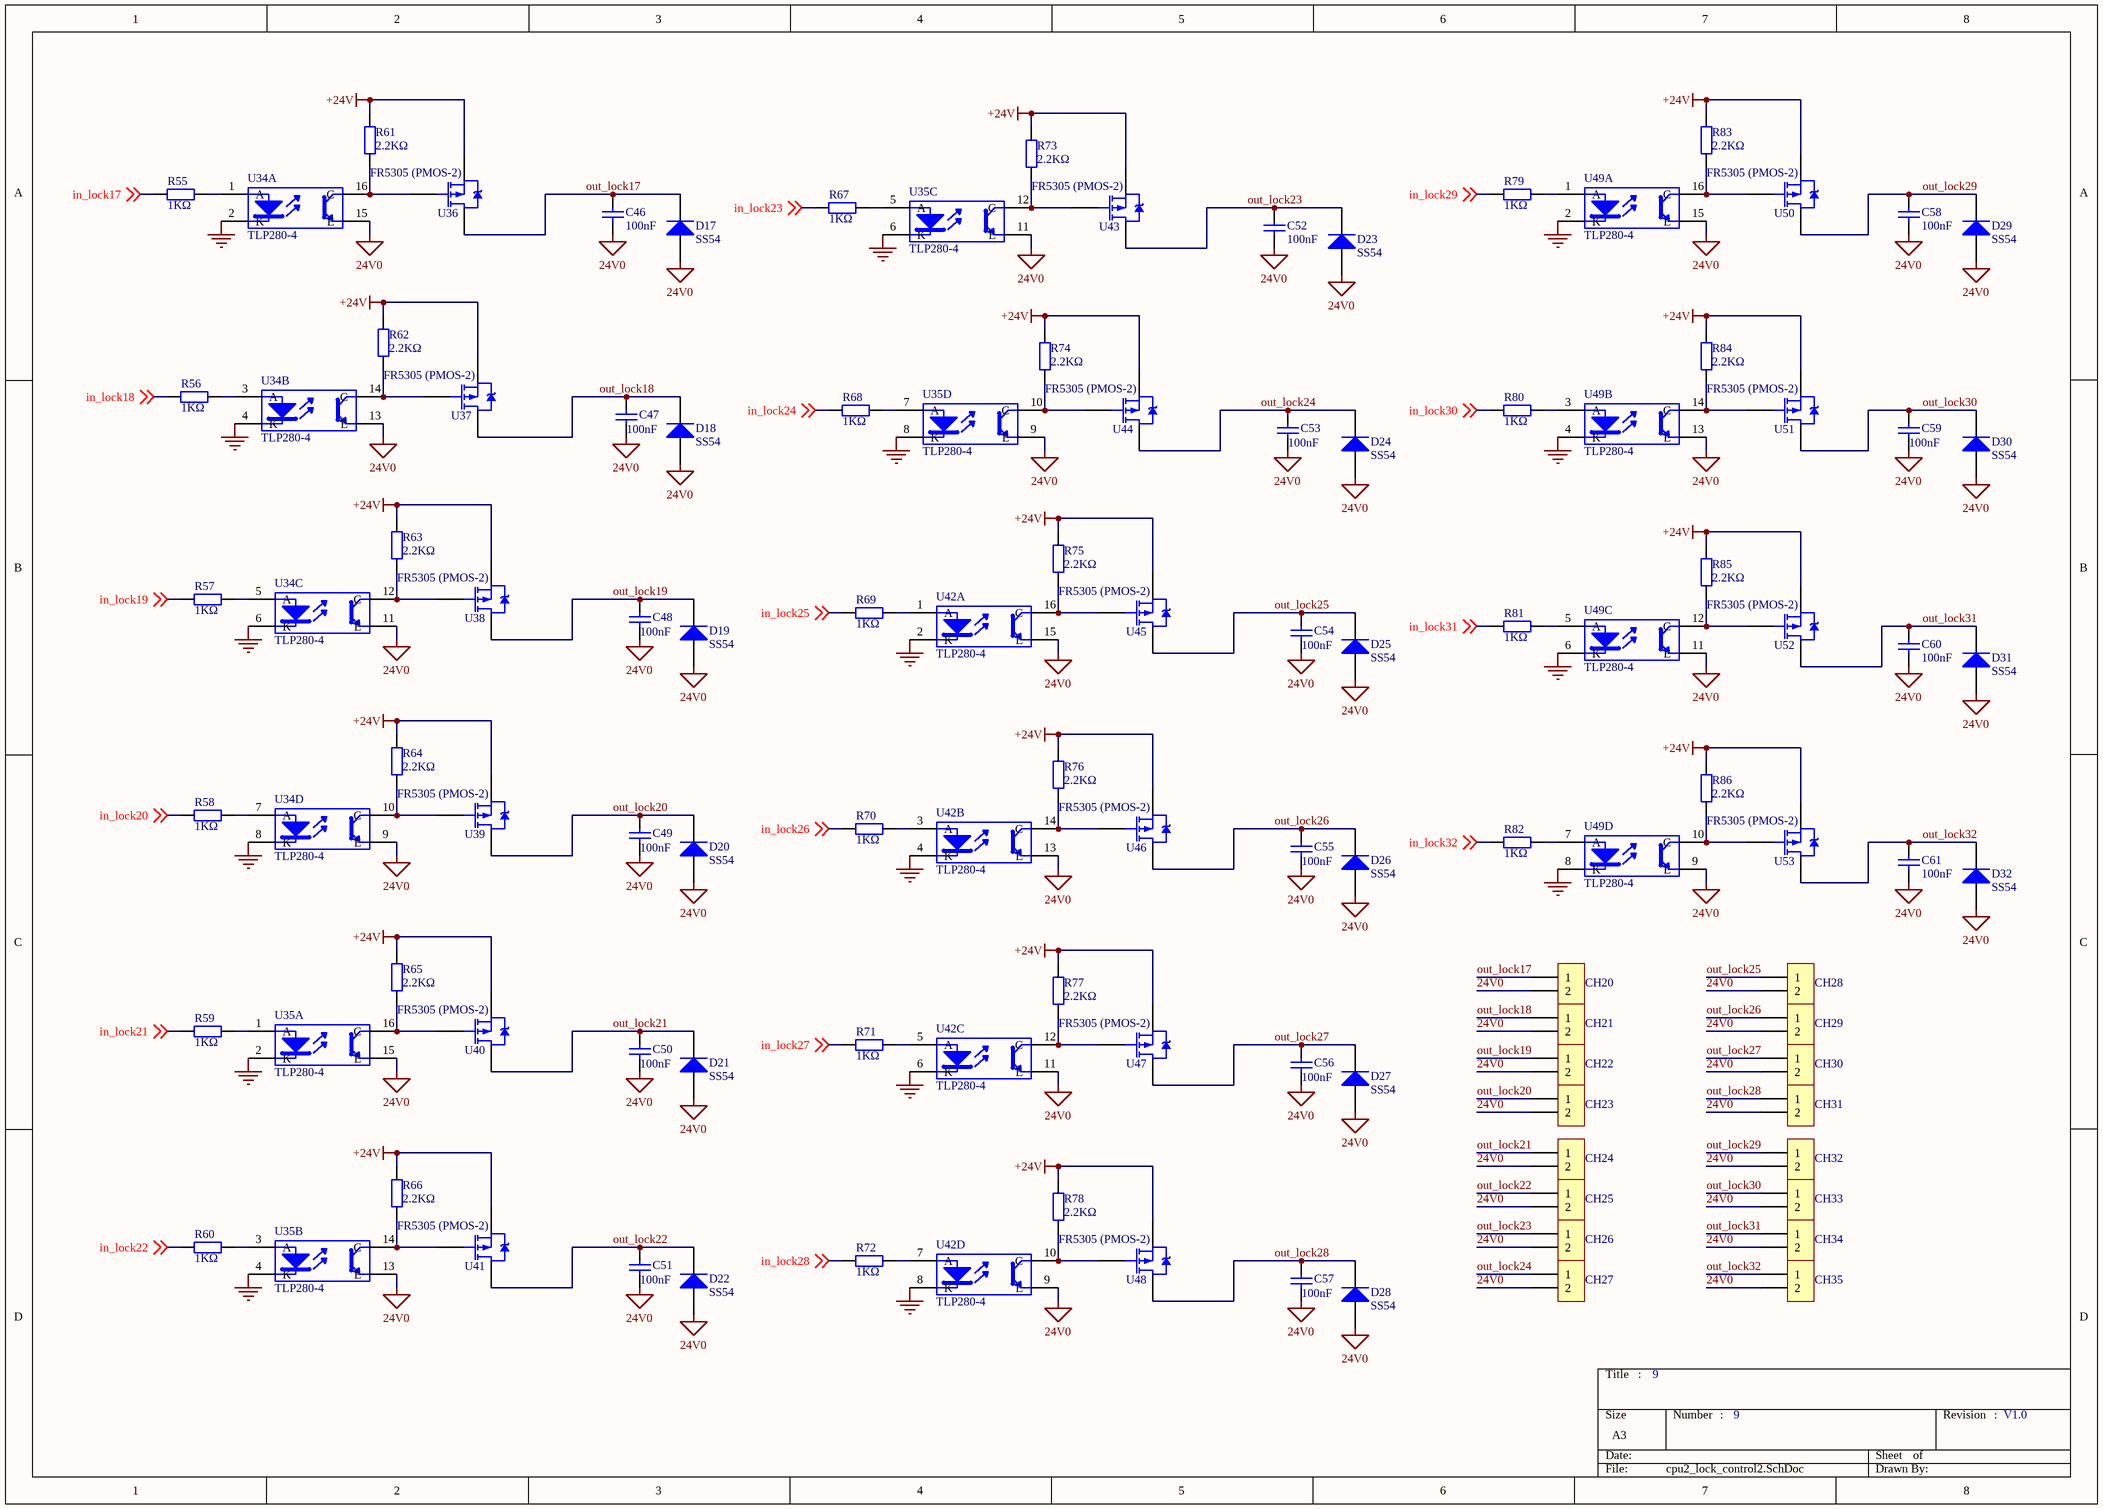
[diagram p8: cpu2_lock_control2.SchDoc]

### Parts
C46  100nF  [0805_C]
C47  100nF  [0805_C]
C48  100nF  [0805_C]
C49  100nF  [0805_C]
C50  100nF  [0805_C]
C51  100nF  [0805_C]
C52  100nF  [0805_C]
C53  100nF  [0805_C]
C54  100nF  [0805_C]
C55  100nF  [0805_C]
C56  100nF  [0805_C]
C57  100nF  [0805_C]
C58  100nF  [0805_C]
C59  100nF  [0805_C]
C60  100nF  [0805_C]
C61  100nF  [0805_C]
CH20  HEADER1X2  [CH3.96-2PIN]  (value not drawn)
CH21  HEADER1X2  [CH3.96-2PIN]  (value not drawn)
CH22  HEADER1X2  [CH3.96-2PIN]  (value not drawn)
CH23  HEADER1X2  [CH3.96-2PIN]  (value not drawn)
CH24  HEADER1X2  [CH3.96-2PIN]  (value not drawn)
CH25  HEADER1X2  [CH3.96-2PIN]  (value not drawn)
CH26  HEADER1X2  [CH3.96-2PIN]  (value not drawn)
CH27  HEADER1X2  [CH3.96-2PIN]  (value not drawn)
CH28  HEADER1X2  [CH3.96-2PIN]  (value not drawn)
CH29  HEADER1X2  [CH3.96-2PIN]  (value not drawn)
CH30  HEADER1X2  [CH3.96-2PIN]  (value not drawn)
CH31  HEADER1X2  [CH3.96-2PIN]  (value not drawn)
CH32  HEADER1X2  [CH3.96-2PIN]  (value not drawn)
CH33  HEADER1X2  [CH3.96-2PIN]  (value not drawn)
CH34  HEADER1X2  [CH3.96-2PIN]  (value not drawn)
CH35  HEADER1X2  [CH3.96-2PIN]  (value not drawn)
D17  SS54  [SMA(DO-214AC)_S1]
D18  SS54  [SMA(DO-214AC)_S1]
D19  SS54  [SMA(DO-214AC)_S1]
D20  SS54  [SMA(DO-214AC)_S1]
D21  SS54  [SMA(DO-214AC)_S1]
D22  SS54  [SMA(DO-214AC)_S1]
D23  SS54  [SMA(DO-214AC)_S1]
D24  SS54  [SMA(DO-214AC)_S1]
D25  SS54  [SMA(DO-214AC)_S1]
D26  SS54  [SMA(DO-214AC)_S1]
D27  SS54  [SMA(DO-214AC)_S1]
D28  SS54  [SMA(DO-214AC)_S1]
D29  SS54  [SMA(DO-214AC)_S1]
D30  SS54  [SMA(DO-214AC)_S1]
D31  SS54  [SMA(DO-214AC)_S1]
D32  SS54  [SMA(DO-214AC)_S1]
R55  1KΩ  [0805_R]
R56  1KΩ  [0805_R]
R57  1KΩ  [0805_R]
R58  1KΩ  [0805_R]
R59  1KΩ  [0805_R]
R60  1KΩ  [0805_R]
R61  2.2KΩ  [0805_R]
R62  2.2KΩ  [0805_R]
R63  2.2KΩ  [0805_R]
R64  2.2KΩ  [0805_R]
R65  2.2KΩ  [0805_R]
R66  2.2KΩ  [0805_R]
R67  1KΩ  [0805_R]
R68  1KΩ  [0805_R]
R69  1KΩ  [0805_R]
R70  1KΩ  [0805_R]
R71  1KΩ  [0805_R]
R72  1KΩ  [0805_R]
R73  2.2KΩ  [0805_R]
R74  2.2KΩ  [0805_R]
R75  2.2KΩ  [0805_R]
R76  2.2KΩ  [0805_R]
R77  2.2KΩ  [0805_R]
R78  2.2KΩ  [0805_R]
R79  1KΩ  [0805_R]
R80  1KΩ  [0805_R]
R81  1KΩ  [0805_R]
R82  1KΩ  [0805_R]
R83  2.2KΩ  [0805_R]
R84  2.2KΩ  [0805_R]
R85  2.2KΩ  [0805_R]
R86  2.2KΩ  [0805_R]
U34  TLP280-4  [SO16]  (parts A,B,C,D of 4)
U35  TLP280-4  [SO16]  (parts A,B,C,D of 4)
U36  FR5305 (PMOS-2)  [TO-252]
U37  FR5305 (PMOS-2)  [TO-252]
U38  FR5305 (PMOS-2)  [TO-252]
U39  FR5305 (PMOS-2)  [TO-252]
U40  FR5305 (PMOS-2)  [TO-252]
U41  FR5305 (PMOS-2)  [TO-252]
U42  TLP280-4  [SO16]  (parts A,B,C,D of 4)
U43  FR5305 (PMOS-2)  [TO-252]
U44  FR5305 (PMOS-2)  [TO-252]
U45  FR5305 (PMOS-2)  [TO-252]
U46  FR5305 (PMOS-2)  [TO-252]
U47  FR5305 (PMOS-2)  [TO-252]
U48  FR5305 (PMOS-2)  [TO-252]
U49  TLP280-4  [SO16]  (parts A,B,C,D of 4)
U50  FR5305 (PMOS-2)  [TO-252]
U51  FR5305 (PMOS-2)  [TO-252]
U52  FR5305 (PMOS-2)  [TO-252]
U53  FR5305 (PMOS-2)  [TO-252]

### Nets
24V0: C46.1 C47.1 C48.1 C49.1 C50.1 C51.1 C52.1 C53.1 C54.1 C55.1 C56.1 C57.1 C58.1 C59.1 C60.1 C61.1 CH20.2 CH21.2 CH22.2 CH23.2 CH24.2 CH25.2 CH26.2 CH27.2 CH28.2 CH29.2 CH30.2 CH31.2 CH32.2 CH33.2 CH34.2 CH35.2 D17.1(A) D18.1(A) D19.1(A) D20.1(A) D21.1(A) D22.1(A) D23.1(A) D24.1(A) D25.1(A) D26.1(A) D27.1(A) D28.1(A) D29.1(A) D30.1(A) D31.1(A) D32.1(A) U34.9(E) U34.11(E) U34.13(E) U34.15(E) U35.9(E) U35.11(E) U35.13(E) U35.15(E) U42.9(E) U42.11(E) U42.13(E) U42.15(E) U49.9(E) U49.11(E) U49.13(E) U49.15(E)
+24V: R61.2 R62.2 R63.2 R64.2 R65.2 R66.2 R73.2 R74.2 R75.2 R76.2 R77.2 R78.2 R83.2 R84.2 R85.2 R86.2 U36.3(S) U37.3(S) U38.3(S) U39.3(S) U40.3(S) U41.3(S) U43.3(S) U44.3(S) U45.3(S) U46.3(S) U47.3(S) U48.3(S) U50.3(S) U51.3(S) U52.3(S) U53.3(S)
GND: U34.2(K) U34.4(K) U34.6(K) U34.8(K) U35.2(K) U35.4(K) U35.6(K) U35.8(K) U42.2(K) U42.4(K) U42.6(K) U42.8(K) U49.2(K) U49.4(K) U49.6(K) U49.8(K)
in_lock17: R55.1 ; off-sheet in_lock17
in_lock18: R56.1 ; off-sheet in_lock18
in_lock19: R57.1 ; off-sheet in_lock19
in_lock20: R58.1 ; off-sheet in_lock20
in_lock21: R59.1 ; off-sheet in_lock21
in_lock22: R60.1 ; off-sheet in_lock22
in_lock23: R67.1 ; off-sheet in_lock23
in_lock24: R68.1 ; off-sheet in_lock24
in_lock25: R69.1 ; off-sheet in_lock25
in_lock26: R70.1 ; off-sheet in_lock26
in_lock27: R71.1 ; off-sheet in_lock27
in_lock28: R72.1 ; off-sheet in_lock28
in_lock29: R79.1 ; off-sheet in_lock29
in_lock30: R80.1 ; off-sheet in_lock30
in_lock31: R81.1 ; off-sheet in_lock31
in_lock32: R82.1 ; off-sheet in_lock32
out_lock17: C46.2 CH20.1 D17.2(K) U36.2(D)
out_lock18: C47.2 CH21.1 D18.2(K) U37.2(D)
out_lock19: C48.2 CH22.1 D19.2(K) U38.2(D)
out_lock20: C49.2 CH23.1 D20.2(K) U39.2(D)
out_lock21: C50.2 CH24.1 D21.2(K) U40.2(D)
out_lock22: C51.2 CH25.1 D22.2(K) U41.2(D)
out_lock23: C52.2 CH26.1 D23.2(K) U43.2(D)
out_lock24: C53.2 CH27.1 D24.2(K) U44.2(D)
out_lock25: C54.2 CH28.1 D25.2(K) U45.2(D)
out_lock26: C55.2 CH29.1 D26.2(K) U46.2(D)
out_lock27: C56.2 CH30.1 D27.2(K) U47.2(D)
out_lock28: C57.2 CH31.1 D28.2(K) U48.2(D)
out_lock29: C58.2 CH32.1 D29.2(K) U50.2(D)
out_lock30: C59.2 CH33.1 D30.2(K) U51.2(D)
out_lock31: C60.2 CH34.1 D31.2(K) U52.2(D)
out_lock32: C61.2 CH35.1 D32.2(K) U53.2(D)
NetR55_2: R55.2 U34.1(A)
NetR56_2: R56.2 U34.3(A)
NetR57_2: R57.2 U34.5(A)
NetR58_2: R58.2 U34.7(A)
NetR59_2: R59.2 U35.1(A)
NetR60_2: R60.2 U35.3(A)
NetR61_1: R61.1 U34.16(C) U36.1(G)
NetR62_1: R62.1 U34.14(C) U37.1(G)
NetR63_1: R63.1 U34.12(C) U38.1(G)
NetR64_1: R64.1 U34.10(C) U39.1(G)
NetR65_1: R65.1 U35.16(C) U40.1(G)
NetR66_1: R66.1 U35.14(C) U41.1(G)
NetR67_2: R67.2 U35.5(A)
NetR68_2: R68.2 U35.7(A)
NetR69_2: R69.2 U42.1(A)
NetR70_2: R70.2 U42.3(A)
NetR71_2: R71.2 U42.5(A)
NetR72_2: R72.2 U42.7(A)
NetR73_1: R73.1 U35.12(C) U43.1(G)
NetR74_1: R74.1 U35.10(C) U44.1(G)
NetR75_1: R75.1 U42.16(C) U45.1(G)
NetR76_1: R76.1 U42.14(C) U46.1(G)
NetR77_1: R77.1 U42.12(C) U47.1(G)
NetR78_1: R78.1 U42.10(C) U48.1(G)
NetR79_2: R79.2 U49.1(A)
NetR80_2: R80.2 U49.3(A)
NetR81_2: R81.2 U49.5(A)
NetR82_2: R82.2 U49.7(A)
NetR83_1: R83.1 U49.16(C) U50.1(G)
NetR84_1: R84.1 U49.14(C) U51.1(G)
NetR85_1: R85.1 U49.12(C) U52.1(G)
NetR86_1: R86.1 U49.10(C) U53.1(G)

### Notes on the sheet
- :

### Library data of the parts
C46-C61 = 0805 100nF(104) 10% 50V: 贴片电容; ComponentLink1Description: 供应商链接; ComponentLink1URL: http://www.szlcsc.com/product/details_50686.html; Package: 0805; Supplier: LC; SuppliersPartNumber: C49678
D17-D32 = SMA(DO-214AC) SS54: 二极管; ComponentLink1Description: 供应商链接; ComponentLink1URL: http://www.szlcsc.com/product/details_23178.html; Package: SMA(DO-214AC); Supplier: LC; SuppliersPartNumber: C22452
R55-R86 = 0805 11KΩ (1102) 1%: 贴片电阻; ComponentLink1Description: 供应商链接; ComponentLink1URL: http://www.szlcsc.com/product/details_18117.html; Package: 0805; Supplier: LC; SuppliersPartNumber: C17429
U34 U35 U42 U49 = TLP521-4
U36-U41 U43-U48 U50-U53 = PMOS-2: as U16 on sheet cpu2_lock_control1; Published: 8-Jun-2000; LatestRevisionDate: 17-Jul-2002; LatestRevisionNote: Re-released for DXP Platform.; DatasheetDocument: PD-9.390D; PackageReference: TO-220AB; Publisher: Altium Limited; Code_JEDEC: TO-220-AB; ComponentLink1Description: Manufacturer Link; ComponentLink1URL: http://www.irf.com/

## Nets that join several sheets
24V0: cpu2_lock_control1 (64 pins), power (7 pins), cpu2_lock_control2 (64 pins)
+3.3V: cpu2_lock (23 pins), cpu1_gsm_module (R15.2), cpu2_lock_comm (6 pins), power (5 pins), cpu1_gsm (15 pins), cpu1_gsm_comm (C14.2 C15.2 U5.8 U6.8)
+5V: cpu1_gsm_module (C16.1 C17.2 C18.2 U7.1), power (5 pins)
+24V: cpu2_lock_control1 (32 pins), power (6 pins), cpu2_lock_control2 (32 pins)
GND: cpu2_lock (19 pins), cpu1_gsm_module (C16.2 C17.1 C18.1 U7.3), cpu2_lock_comm (7 pins), cpu2_lock_control1 (16 pins), power (8 pins), cpu1_gsm (17 pins), cpu1_gsm_comm (C14.1 C15.1 U5.5 U6.5), cpu2_lock_control2 (16 pins)
CPU1_GSM_EN: cpu1_gsm_module (R14.2), cpu1_gsm (U4.32)
CPU1_GSM_PWR: cpu1_gsm_module (R17.1), cpu1_gsm (U4.29)
CPU1_PC_RE485: cpu1_gsm (U4.14), cpu1_gsm_comm (U5.2 U5.3)
CPU1_TM_RE485: cpu1_gsm (U4.25), cpu1_gsm_comm (U6.2 U6.3)
CPU1_USART1_RXD: cpu1_gsm_module (U7.4), cpu1_gsm (U4.31)
CPU1_USART1_TXD: cpu1_gsm_module (U7.5), cpu1_gsm (U4.30)
CPU1_USART2_RXD: cpu1_gsm (U4.13), cpu1_gsm_comm (U5.1)
CPU1_USART2_TXD: cpu1_gsm (U4.12), cpu1_gsm_comm (U5.4)
CPU1_USART3_RXD: cpu1_gsm (U4.22), cpu1_gsm_comm (U6.1)
CPU1_USART3_TXD: cpu1_gsm (U4.21), cpu1_gsm_comm (U6.4)
CPU2_NET_RST: cpu2_lock (U9.29), cpu2_lock_comm (ESD4.2 U13.4)
CPU2_USART1_RXD: cpu2_lock (U9.31), cpu2_lock_comm (ESD3.2 U13.9)
CPU2_USART1_TXD: cpu2_lock (U9.30), cpu2_lock_comm (ESD2.2 U13.8)
in_lock1: cpu2_lock (U8.15), cpu2_lock_control1 (R23.1)
in_lock2: cpu2_lock (U8.1), cpu2_lock_control1 (R24.1)
in_lock3: cpu2_lock (U8.2), cpu2_lock_control1 (R25.1)
in_lock4: cpu2_lock (U8.3), cpu2_lock_control1 (R26.1)
in_lock5: cpu2_lock (U8.4), cpu2_lock_control1 (R27.1)
in_lock6: cpu2_lock (U8.5), cpu2_lock_control1 (R28.1)
in_lock7: cpu2_lock (U8.6), cpu2_lock_control1 (R35.1)
in_lock8: cpu2_lock (U8.7), cpu2_lock_control1 (R36.1)
in_lock9: cpu2_lock (U10.15), cpu2_lock_control1 (R37.1)
in_lock10: cpu2_lock (U10.1), cpu2_lock_control1 (R38.1)
in_lock11: cpu2_lock (U10.2), cpu2_lock_control1 (R39.1)
in_lock12: cpu2_lock (U10.3), cpu2_lock_control1 (R40.1)
in_lock13: cpu2_lock (U10.4), cpu2_lock_control1 (R47.1)
in_lock14: cpu2_lock (U10.5), cpu2_lock_control1 (R48.1)
in_lock15: cpu2_lock (U10.6), cpu2_lock_control1 (R49.1)
in_lock16: cpu2_lock (U10.7), cpu2_lock_control1 (R50.1)
in_lock17: cpu2_lock (U11.15), cpu2_lock_control2 (R55.1)
in_lock18: cpu2_lock (U11.1), cpu2_lock_control2 (R56.1)
in_lock19: cpu2_lock (U11.2), cpu2_lock_control2 (R57.1)
in_lock20: cpu2_lock (U11.3), cpu2_lock_control2 (R58.1)
in_lock21: cpu2_lock (U11.4), cpu2_lock_control2 (R59.1)
in_lock22: cpu2_lock (U11.5), cpu2_lock_control2 (R60.1)
in_lock23: cpu2_lock (U11.6), cpu2_lock_control2 (R67.1)
in_lock24: cpu2_lock (U11.7), cpu2_lock_control2 (R68.1)
in_lock25: cpu2_lock (U12.15), cpu2_lock_control2 (R69.1)
in_lock26: cpu2_lock (U12.1), cpu2_lock_control2 (R70.1)
in_lock27: cpu2_lock (U12.2), cpu2_lock_control2 (R71.1)
in_lock28: cpu2_lock (U12.3), cpu2_lock_control2 (R72.1)
in_lock29: cpu2_lock (U12.4), cpu2_lock_control2 (R79.1)
in_lock30: cpu2_lock (U12.5), cpu2_lock_control2 (R80.1)
in_lock31: cpu2_lock (U12.6), cpu2_lock_control2 (R81.1)
in_lock32: cpu2_lock (U12.7), cpu2_lock_control2 (R82.1)